# Altium schematic sheet Sch_LogicDesign.SchDoc
size A; SheetNumber: 1; SheetTotal: 1
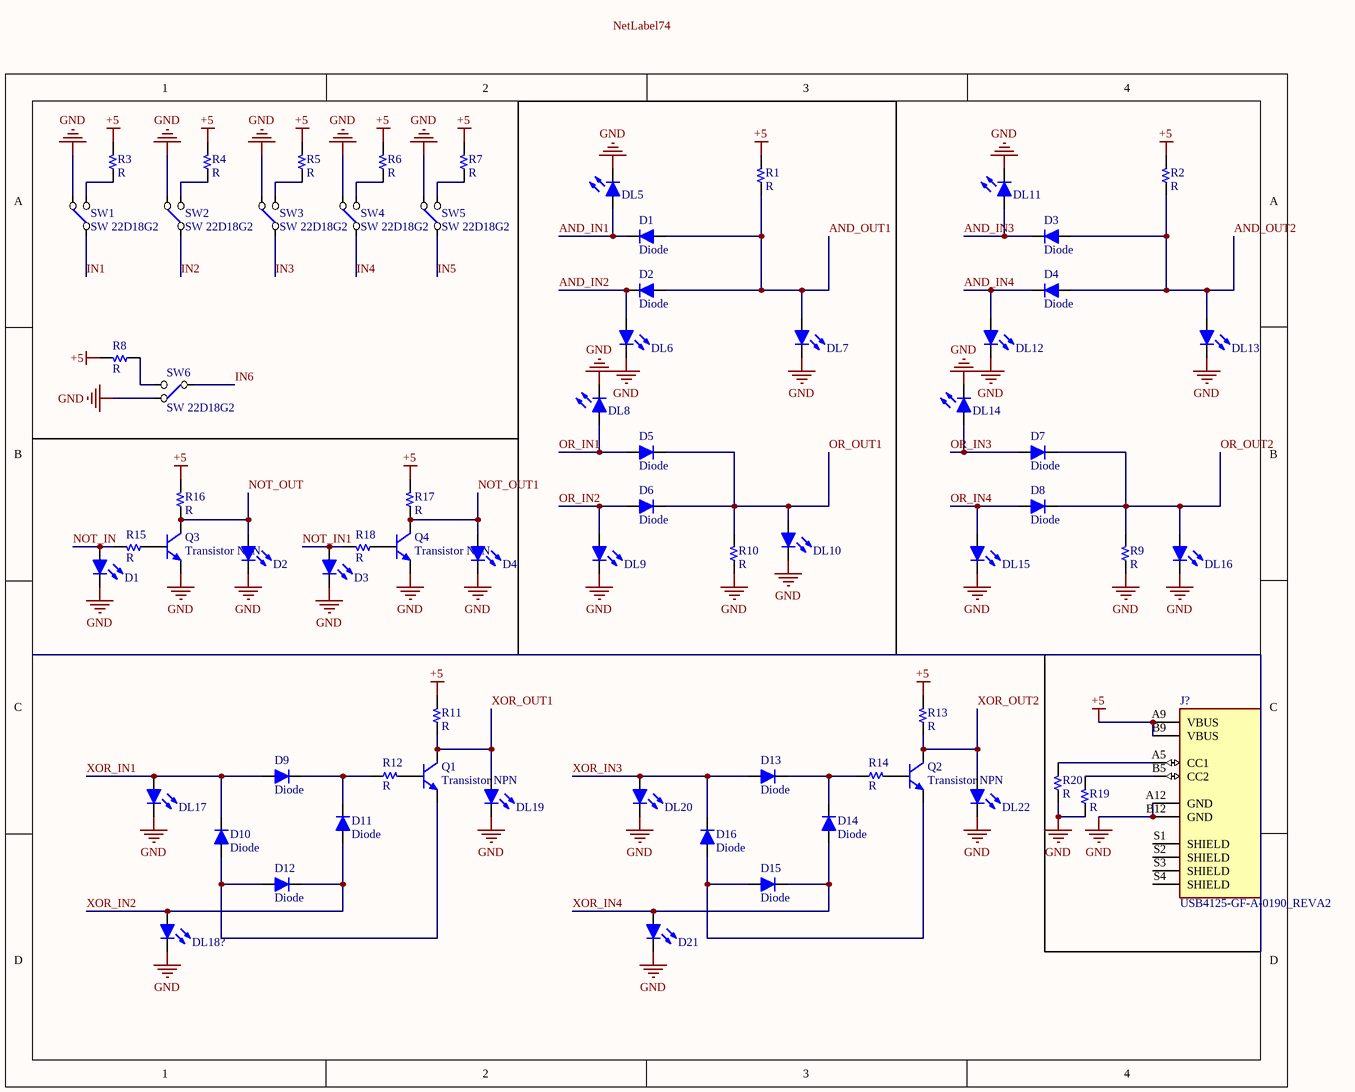
[diagram p0: Sch_LogicDesign.SchDoc]

## Parts
(Parts that share a designator on the sheet are numbered #1, #2 ... from top to bottom, then left to right.)
D1#1  Diode  [DO-214AC (SMA)]
D1#2  Led  [LED 3MM - red]  (value not drawn)
D2#1  Diode  [DO-214AC (SMA)]
D2#2  Led  [LED 3MM - red]  (value not drawn)
D3#1  Diode  [DO-214AC (SMA)]
D3#2  Led  [LED 3MM - red]  (value not drawn)
D4#1  Diode  [DO-214AC (SMA)]
D4#2  Led  [LED 3MM - red]  (value not drawn)
D5  Diode  [DO-214AC (SMA)]
D6  Diode  [DO-214AC (SMA)]
D7  Diode  [DO-214AC (SMA)]
D8  Diode  [DO-214AC (SMA)]
D9  Diode  [DO-214AC (SMA)]
D10  Diode  [DO-214AC (SMA)]
D11  Diode  [DO-214AC (SMA)]
D12  Diode  [DO-214AC (SMA)]
D13  Diode  [DO-214AC (SMA)]
D14  Diode  [DO-214AC (SMA)]
D15  Diode  [DO-214AC (SMA)]
D16  Diode  [DO-214AC (SMA)]
D21  Led  [LED 3MM - red]  (value not drawn)
DL5  Led  [LED 3MM - red]  (value not drawn)
DL6  Led  [LED 3MM - red]  (value not drawn)
DL7  Led  [LED 3MM - red]  (value not drawn)
DL8  Led  [LED 3MM - red]  (value not drawn)
DL9  Led  [LED 3MM - red]  (value not drawn)
DL10  Led  [LED 3MM - red]  (value not drawn)
DL11  Led  [LED 3MM - red]  (value not drawn)
DL12  Led  [LED 3MM - red]  (value not drawn)
DL13  Led  [LED 3MM - red]  (value not drawn)
DL14  Led  [LED 3MM - red]  (value not drawn)
DL15  Led  [LED 3MM - red]  (value not drawn)
DL16  Led  [LED 3MM - red]  (value not drawn)
DL17  Led  [LED 3MM - red]  (value not drawn)
DL18?  Led  [LED 3MM - red]  (value not drawn)
DL19  Led  [LED 3MM - red]  (value not drawn)
DL20  Led  [LED 3MM - red]  (value not drawn)
DL22  Led  [LED 3MM - red]  (value not drawn)
J?  USB4125-GF-A-0190_REVA2  [GCT_USB4125-GF-A-0190_REVA2]
Q1  Transistor NPN  [SOT-23]
Q2  Transistor NPN  [SOT-23]
Q3  Transistor NPN  [SOT-23]
Q4  Transistor NPN  [SOT-23]
R1  R  [R 0805]
R2  R  [R 0805]
R3  R  [R 0805]
R4  R  [R 0805]
R5  R  [R 0805]
R6  R  [R 0805]
R7  R  [R 0805]
R8  R  [R 0805]
R9  R  [R 0805]
R10  R  [R 0805]
R11  R  [R 0805]
R12  R  [R 0805]
R13  R  [R 0805]
R14  R  [R 0805]
R15  R  [R 0805]
R16  R  [R 0805]
R17  R  [R 0805]
R18  R  [R 0805]
R19  R  [R 0805]
R20  R  [R 0805]
SW1  SW 22D18G2  [MST22D18G2]
SW2  SW 22D18G2  [MST22D18G2]
SW3  SW 22D18G2  [MST22D18G2]
SW4  SW 22D18G2  [MST22D18G2]
SW5  SW 22D18G2  [MST22D18G2]
SW6  SW 22D18G2  [MST22D18G2]

## Nets
+5: J?.A9(VBUS) J?.B9(VBUS) R1.2 R2.2 R3.2 R4.2 R5.2 R6.2 R7.2 R8.2 R11.2 R13.2 R16.2 R17.2
GND: D1#2.2(K) D2#2.2(K) D3#2.2(K) D4#2.2(K) D21.2(K) DL5.2(K) DL6.2(K) DL7.2(K) DL8.2(K) DL9.2(K) DL10.2(K) DL11.2(K) DL12.2(K) DL13.2(K) DL14.2(K) DL15.2(K) DL16.2(K) DL17.2(K) DL18?.2(K) DL19.2(K) DL20.2(K) DL22.2(K) J?.A12(GND) J?.B12(GND) Q3.2(E) Q4.2(E) R9.1 R10.1 R19.1 R20.1 SW1.1(NC1) SW2.1(NC1) SW3.1(NC1) SW4.1(NC1) SW5.1(NC1) SW6.1(NC1)
AND_IN1: D1#1.2(K) DL5.1(A)
AND_IN2: D2#1.2(K) DL6.1(A)
AND_IN3: D3#1.2(K) DL11.1(A)
AND_IN4: D4#1.2(K) DL12.1(A)
AND_OUT1: D1#1.1(A) D2#1.1(A) DL7.1(A) R1.1
AND_OUT2: D3#1.1(A) D4#1.1(A) DL13.1(A) R2.1
IN1: SW1.2(COMMON1)
IN2: SW2.2(COMMON1)
IN3: SW3.2(COMMON1)
IN4: SW4.2(COMMON1)
IN5: SW5.2(COMMON1)
IN6: SW6.2(COMMON1)
NOT_IN: D1#2.1(A) R15.2
NOT_IN1: D3#2.1(A) R18.2
NOT_OUT: D2#2.1(A) Q3.3(C) R16.1
NOT_OUT1: D4#2.1(A) Q4.3(C) R17.1
OR_IN1: D5.1(A) DL8.1(A)
OR_IN2: D6.1(A) DL9.1(A)
OR_IN3: D7.1(A) DL14.1(A)
OR_IN4: D8.1(A) DL15.1(A)
OR_OUT1: D5.2(K) D6.2(K) DL10.1(A) R10.2
OR_OUT2: D7.2(K) D8.2(K) DL16.1(A) R9.2
XOR_IN1: D9.1(A) D10.2(K) DL17.1(A)
XOR_IN2: D11.1(A) D12.2(K) DL18?.1(A)
XOR_IN3: D13.1(A) D16.2(K) DL20.1(A)
XOR_IN4: D14.1(A) D15.2(K) D21.1(A)
XOR_OUT1: DL19.1(A) Q1.3(C) R11.1
XOR_OUT2: DL22.1(A) Q2.3(C) R13.1
NetD9_2: D9.2(K) D11.2(K) R12.1
NetD10_1: D10.1(A) D12.1(A) Q1.2(E)
NetD13_2: D13.2(K) D14.2(K) R14.1
NetD15_1: D15.1(A) D16.1(A) Q2.2(E)
NetJ?_A5: J?.A5(CC1) R20.2
NetJ?_B5: J?.B5(CC2) R19.2
NetQ1_1: Q1.1(B) R12.2
NetQ2_1: Q2.1(B) R14.2
NetQ3_1: Q3.1(B) R15.1
NetQ4_1: Q4.1(B) R18.1
NetR3_1: R3.1 SW1.3(NO1)
NetR4_1: R4.1 SW2.3(NO1)
NetR5_1: R5.1 SW3.3(NO1)
NetR6_1: R6.1 SW4.3(NO1)
NetR7_1: R7.1 SW5.3(NO1)
NetR8_1: R8.1 SW6.3(NO1)

Not connected (* = marked no-connect by the designer): J? S1(SHIELD) S2(SHIELD) S3(SHIELD) S4(SHIELD)

## Notes on the sheet
- Labels drawn without touching a wire or pin: NetLabel74

## Library data of the parts
D1#1 D2#1 D3#1 D4#1 D5-D16 = Diode: Default Diode
D1#2 D2#2 D3#2 D4#2 D21 DL5-DL17 DL18? DL19 DL20 DL22 = Led: Typical LED
J? = USB4125-GF-A-0190_REVA2: Type C Receptacle, Horizontal, SMT, For Power Charging Only; MF: Global Connector Technology; Price: None; Check_prices: https://www.snapeda.com/parts/USB4125-GF-A-0190/Global%20Connector%20Technology/view-part/6227012/?ref=eda; Package: None; Value: *; MP: USB4125-GF-A-0190; SnapEDA_Link: https://www.snapeda.com/parts/USB4125-GF-A-0190/Global%20Connector%20Technology/view-part/6227012/?ref=snap; Availability: No availability data
Q1-Q4 = Transistor NPN: NPN Bipolar Transistor
R1-R20 = Resistor